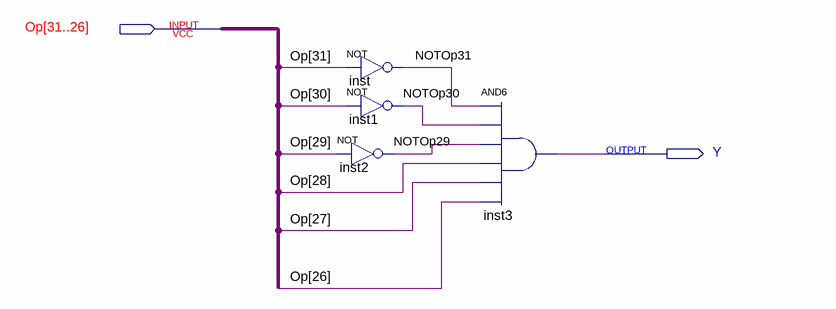
[diagram p0: schematic sheet]
// Quartus schematic BGTZ.bdf as structural Verilog: 4 symbols, 2 pins
module BGTZ (
  input  [31:26] Op,
  output Y
);

  wire NOTOp29, NOTOp30, NOTOp31;

  not inst (NOTOp31, Op[31]);
  not inst1 (NOTOp30, Op[30]);
  not inst2 (NOTOp29, Op[29]);
  and inst3 (Y, NOTOp31, NOTOp30, NOTOp29, Op[28], Op[27], Op[26]);
endmodule
